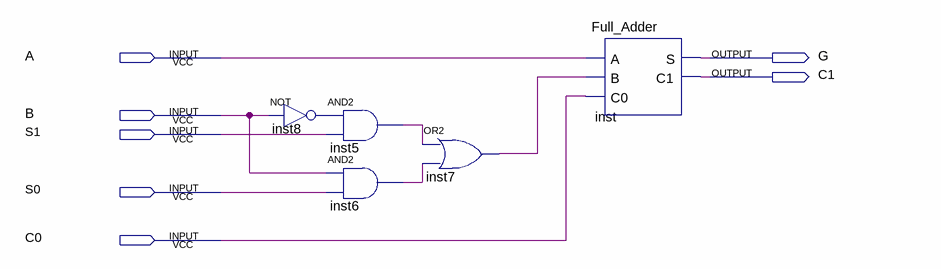
[diagram p0: schematic sheet]
// Quartus schematic Operand_Logic.bdf as structural Verilog: 5 symbols, 7 pins
module Operand_Logic (
  input  A,
  input  B,
  input  S1,
  input  S0,
  input  C0,
  output G,
  output C1
);

  wire inst5_out, inst6_out, inst7_out, inst8_out;

  not inst8 (inst8_out, B);
  and inst5 (inst5_out, inst8_out, S1);
  and inst6 (inst6_out, B, S0);
  or inst7 (inst7_out, inst5_out, inst6_out);
  Full_Adder inst (.A(A), .B(inst7_out), .C0(C0), .S(G), .C1(C1));
endmodule
